# Altium schematic sheet NIC_DP83848.SchDoc
size A4
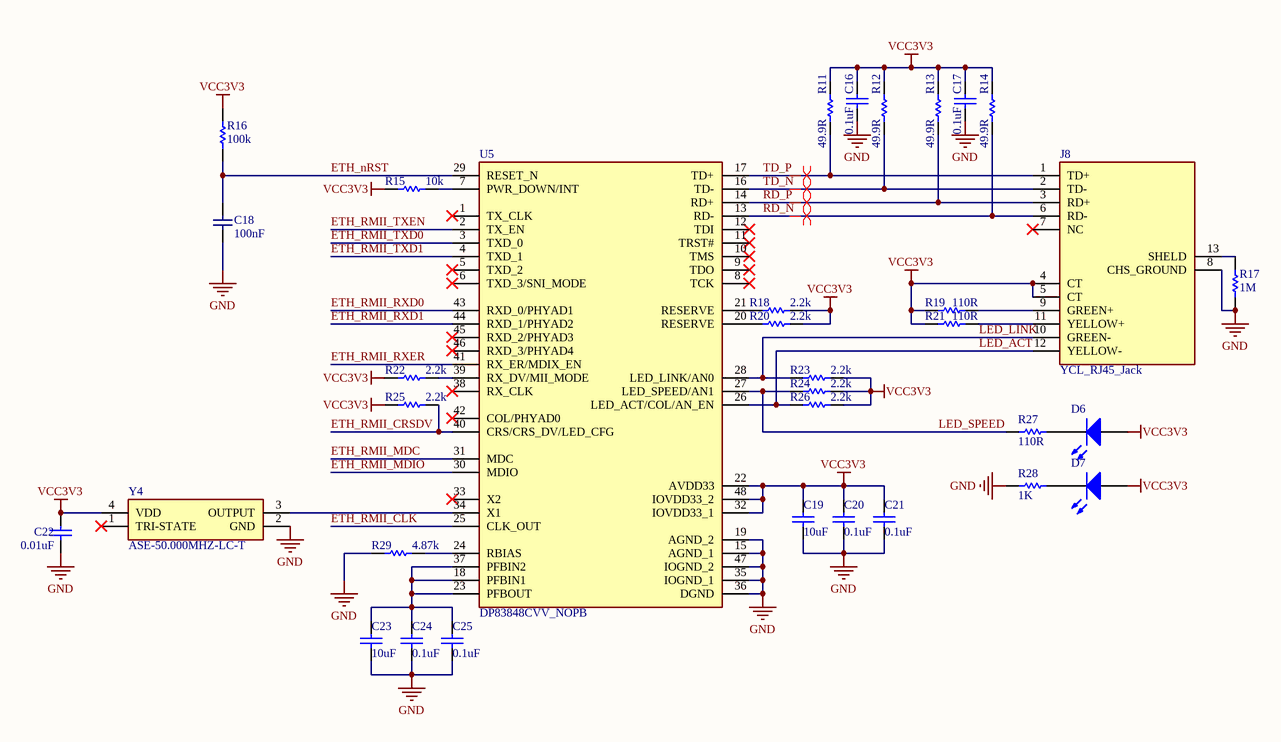
[diagram p0: NIC_DP83848.SchDoc]

## Parts
C16  0.1uF  [SMD0603]
C17  0.1uF  [SMD0603]
C18  100nF  [SMD0603]
C19  10uF  [SMD0603]
C20  0.1uF  [SMD0603]
C21  0.1uF  [SMD0603]
C22  value 0.01uF  [SMD0603]  (hidden comment: 0.1uF)
C23  10uF  [SMD0603]
C24  0.1uF  [SMD0603]
C25  0.1uF  [SMD0603]
D6  LED0  [SMD0603_LED]  (value not drawn)
D7  LED0  [SMD0603_LED]  (value not drawn)
J8  YCL_RJ45_Jack  [YCL_RJ45_Jack]
R11  49.9R  [SMD0603]
R12  49.9R  [SMD0603]
R13  49.9R  [SMD0603]
R14  49.9R  [SMD0603]
R15  10k  [SMD0603]
R16  100K  [SMD0603]
R17  1M  [SMD0603]
R18  2.2k  [SMD0603]
R19  110R  [SMD0603]
R20  2.2k  [SMD0603]
R21  110R  [SMD0603]
R22  2.2k  [SMD0603]
R23  2.2k  [SMD0603]
R24  2.2k  [SMD0603]
R25  2.2k  [SMD0603]
R26  2.2k  [SMD0603]
R27  value 110R  [SMD0603]  (hidden comment: 1K)
R28  1K  [SMD0603]
R29  4.87k  [SMD0603]
U5  DP83848CVV_NOPB  [QFP50P900X900X160-48N]
Y4  ASE-50.000MHZ-LC-T  [OSC3225]

## Nets
GND: C16.2 C17.2 C18.1 C19.2 C20.2 C21.2 C22.2 C23.2 C24.2 C25.2 J8.8(CHS_GROUND) R17.1 R28.1 R29.2 U5.15(AGND_1) U5.19(AGND_2) U5.35(IOGND_1) U5.36(DGND) U5.47(IOGND_2) Y4.2(GND)
VCC3V3: C16.1 C17.1 C19.1 C20.1 C21.1 C22.1 D6.1(A) D7.1(A) J8.4(CT) J8.5(CT) R11.1 R12.1 R13.1 R14.1 R15.2 R16.2 R18.1 R19.1 R20.2 R21.1 R22.2 R23.1 R24.2 R25.2 R26.1 U5.22(AVDD33) U5.32(IOVDD33_1) U5.48(IOVDD33_2) Y4.4(VDD)
ETH_nRST: C18.2 R16.1 U5.29(RESET_N)
ETH_RMII_CLK: U5.25(CLK_OUT)
ETH_RMII_CRSDV: R25.1 U5.40(CRS/CRS_DV/LED_CFG)
ETH_RMII_MDC: U5.31(MDC)
ETH_RMII_MDIO: U5.30(MDIO)
ETH_RMII_RXD0: U5.43(RXD_0/PHYAD1)
ETH_RMII_RXD1: U5.44(RXD_1/PHYAD2)
ETH_RMII_RXER: U5.41(RX_ER/MDIX_EN)
ETH_RMII_TXD0: U5.3(TXD_0)
ETH_RMII_TXD1: U5.4(TXD_1)
ETH_RMII_TXEN: U5.2(TX_EN)
LED_ACT: J8.12(YELLOW-) R26.2 U5.26(LED_ACT/COL/AN_EN)
LED_LINK: J8.10(GREEN-) R23.2 U5.28(LED_LINK/AN0)
LED_SPEED: R24.1 R27.1 U5.27(LED_SPEED/AN1)
RD_N: J8.6(RD-) R14.2 U5.13(RD-)
RD_P: J8.3(RD+) R13.2 U5.14(RD+)
TD_N: J8.2(TD-) R12.2 U5.16(TD-)
TD_P: J8.1(TD+) R11.2 U5.17(TD+)
NetC23_1: C23.1 C24.1 C25.1 U5.18(PFBIN1) U5.23(PFBOUT) U5.37(PFBIN2)
NetD6_2: D6.2(K) R27.2
NetD7_2: D7.2(K) R28.2
NetJ8_9: J8.9(GREEN+) R19.2
NetJ8_11: J8.11(YELLOW+) R21.2
NetJ8_13: J8.13(SHELD) R17.2
NetR15_1: R15.1 U5.7(PWR_DOWN/INT)
NetR18_2: R18.2 U5.21(RESERVE)
NetR20_1: R20.1 U5.20(RESERVE)
NetR22_1: R22.1 U5.39(RX_DV/MII_MODE)
NetR29_1: R29.1 U5.24(RBIAS)
NetU5_34: U5.34(X1) Y4.3(OUTPUT)

Not connected (* = marked no-connect by the designer): J8 7(NC)*; U5 1(TX_CLK)* 5(TXD_2)* 6(TXD_3/SNI_MODE)* 8(TCK)* 9(TDO)* 10(TMS)* 11(TRST#)* 12(TDI)* 33(X2)* 38(RX_CLK)* 42(COL/PHYAD0)* 45(RXD_2/PHYAD3)* 46(RXD_3/PHYAD4)*; Y4 1(TRI-STATE)*

## Layout directives
differential pair: RD_N, RD_P, TD_N, TD_P

## Notes on the sheet
- Title
- Size:
- Date:
- A4
- Number:
- Time:
- Revision:
- Sheet
- of
- File:

## Library data of the parts
C16 C17 C19-C25 = Cap Semi: Capacitor (Semiconductor SIM Model); Published: 8-Jun-2000; LatestRevisionDate: 29-May-2009; LatestRevisionNote: IPC-7351 Footprint Added.; PackageReference: C1206; Publisher: Altium Limited; PackageDescription: Chip Capacitor
  C16 C17 C20 C21 C24 C25: Value: 0.1uF
  C19 C23: Value: 10uF
C18 = Cap: Capacitor (Semiconductor SIM Model); Value: 100nF
D6 D7 = LED0: Typical INFRARED GaAs LED; Published: 8-Jun-2000; LatestRevisionDate: 08-Jul-2005; LatestRevisionNote: Mech Layer 1 removed.; PackageReference: LED-0; Publisher: Altium Limited; PackageDescription: LED; 2 Leads
J8 = YCL_RJ45_Jack: Connector; Manufacturer_Name: Pulse; Manufacturer_Part_Number: J0011D21BNL; Datasheet Link: https://www.mouser.de/datasheet/2/336/J403-370307.pdf; Height: 16.39mm
R11-R15 R17-R29 = Res Semi: Semiconductor Resistor; Published: 8-Jun-2000; LatestRevisionDate: 17-Jul-2002; LatestRevisionNote: Re-released for DXP Platform.; PackageReference: AXIAL-0.5; Publisher: Altium Limited; PackageDescription: Axial Device, Thru-Hole; 2 Leads; 0.5 in Pin Spacing
  R11-R14: Value: 49.9R
  R15: Value: 10k
  R17: Value: 1M
  R18 R20 R22-R26: Value: 2.2k
  R19 R21: Value: 110R
  R28: Value: 1K
  R29: Value: 4.87k
R16 = Res: Semiconductor Resistor; Value: 100k
U5 = DP83848CVV: Ethernet phy
Y4 = ASE-50.000MHZ-LC-T: Crystal or Oscillator; Manufacturer_Name: ABRACON; Datasheet Link: https://componentsearchengine.com//ASE-50.000MHZ-LC-T.pdf; Height: 1.2mm; Mouser2 Part Number: 815-ASE50.000MHZLCT; Mouser2 Price/Stock: https://www.mouser.com/Search/Refine.aspx?Keyword=815-ASE50.000MHZLCT; Manufacturer_Part_Number: ASE-50.000MHZ-LC-T